# EAGLE schematic ccd700_trigger_in (EAGLE 6.6.0)
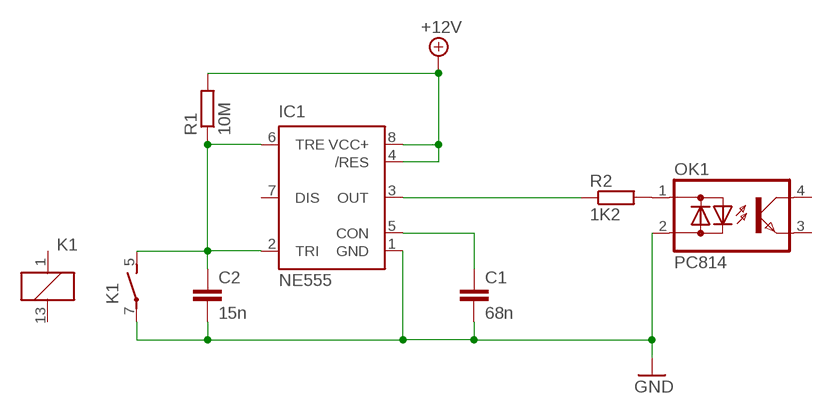
[diagram p0: schematic, sheet 1]

## Parts
C1  68n  C5/3  [C5B3]
C2  15n  C5/3  [C5B3]
IC1  NE555  [DIL-08]
K1  G6D-1A-ASI5VDC  [G6D]
OK1  PC814  [DIL04]
R1  10M  R-EU_0204/7  [0204/7]
R2  1K2  R-EU_0204/7  [0204/7]

## Nets
+12V: IC1.4(/RES) IC1.8(VCC+) R1.2
GND: C1.2 C2.2 IC1.1(GND) K1.7(2:P) OK1.2(AC2)
N$1: C1.1 IC1.5(CON)
N$2: IC1.3(OUT) R2.1
N$3: C2.1 IC1.2(TRI) IC1.6(TRE) K1.5(2:S) R1.1
N$4: OK1.1(AC1) R2.2
Unconnected: IC1.7(DIS) K1.1 K1.13 OK1.3(E) OK1.4(C)

## Library data of the parts
C1 C2 = capacitor-wima:C: CAPACITOR naming: grid - package width
IC1 = st-microelectronics:NE555: General purpose bipolar Timer; MF: Arrow Electronics; MPN: NE555N; OC_FARNELL: 1467742; OC_NEWARK: 89K1486
K1 = relay:G6D?*: OMRON Slim, Miniature PCB Relay 17.5 × 6.5 × 12.5 mm with Socked Source: http://ecb.omron.com.sg/pdf/relay/power/G6D.pdf; OC_FARNELL: 9812660; OC_NEWARK: unknown
OK1 = optocoupler:PC814: SHARP OPTO COUPLER; OC_FARNELL: 9707662; OC_NEWARK: unknown
R1 R2 = resistor:R-EU_: RESISTOR, European symbol